# EAGLE board Primary (EAGLE 5.12), part 1 of 2
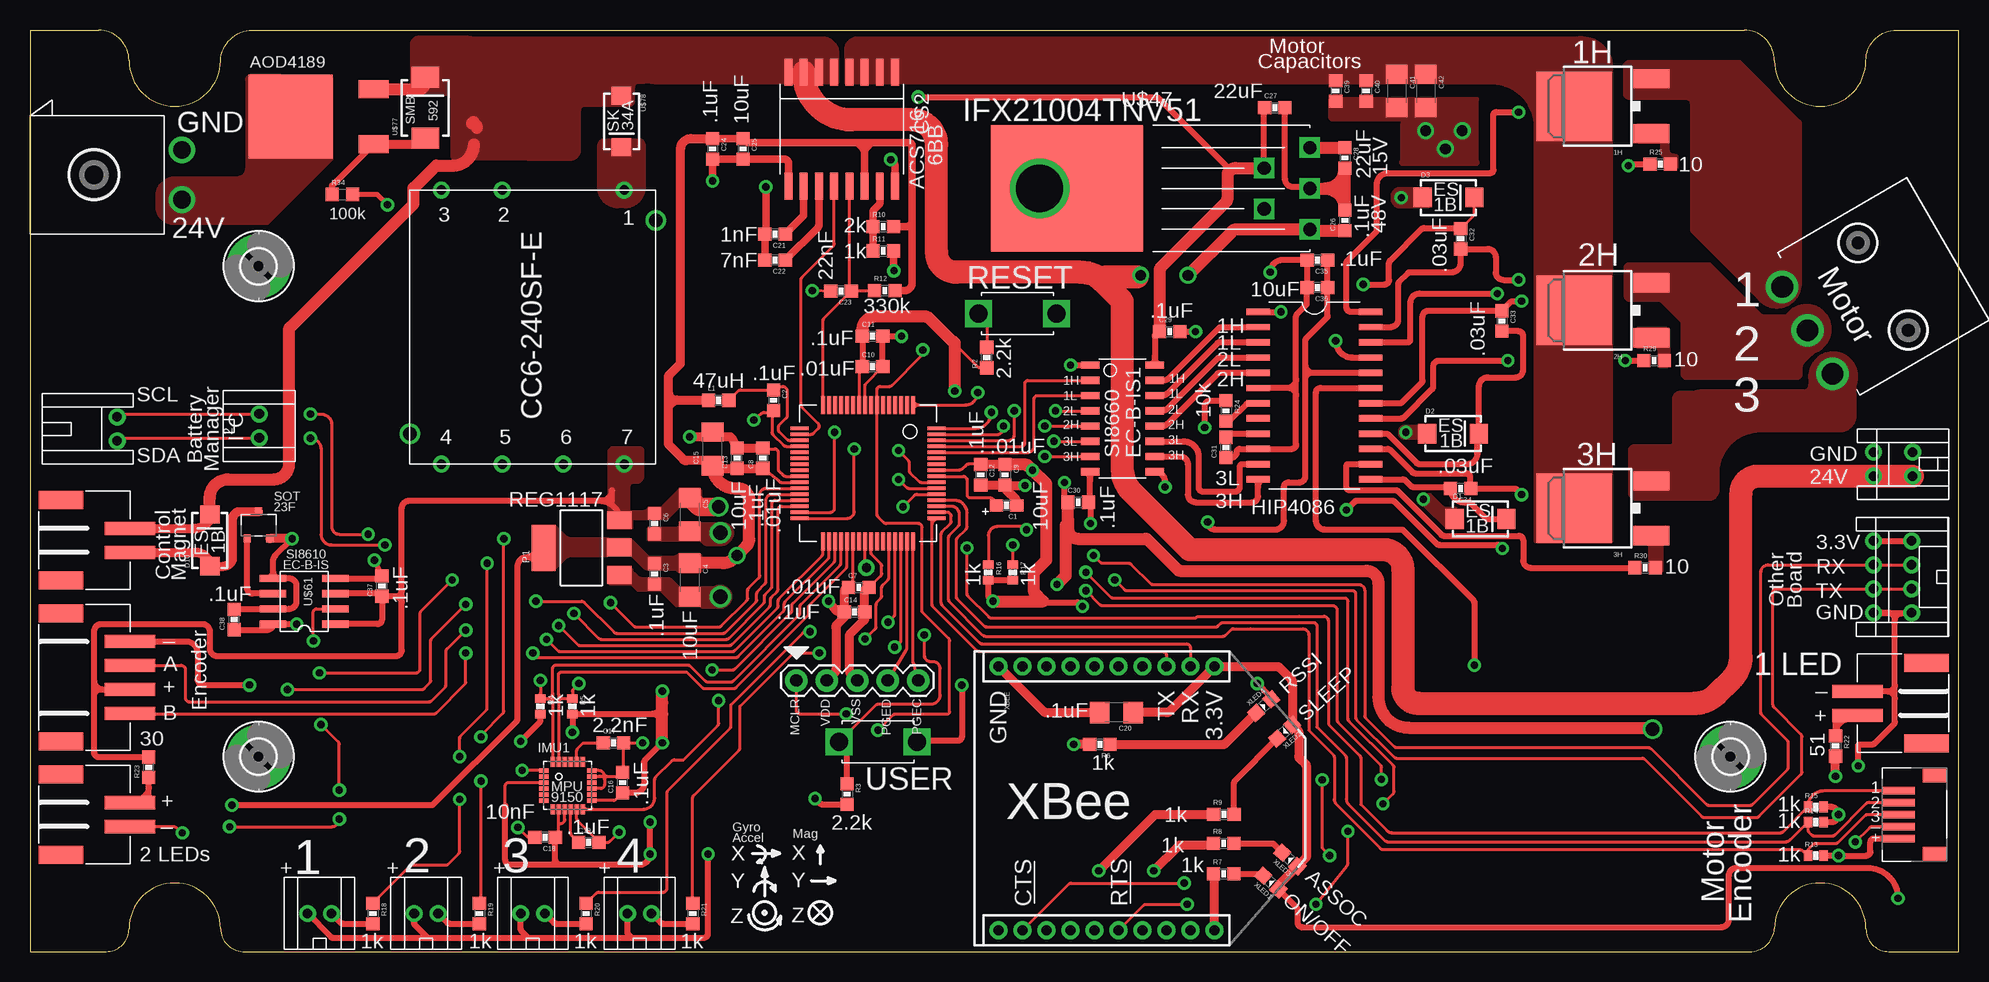
[diagram p5: board, top side]
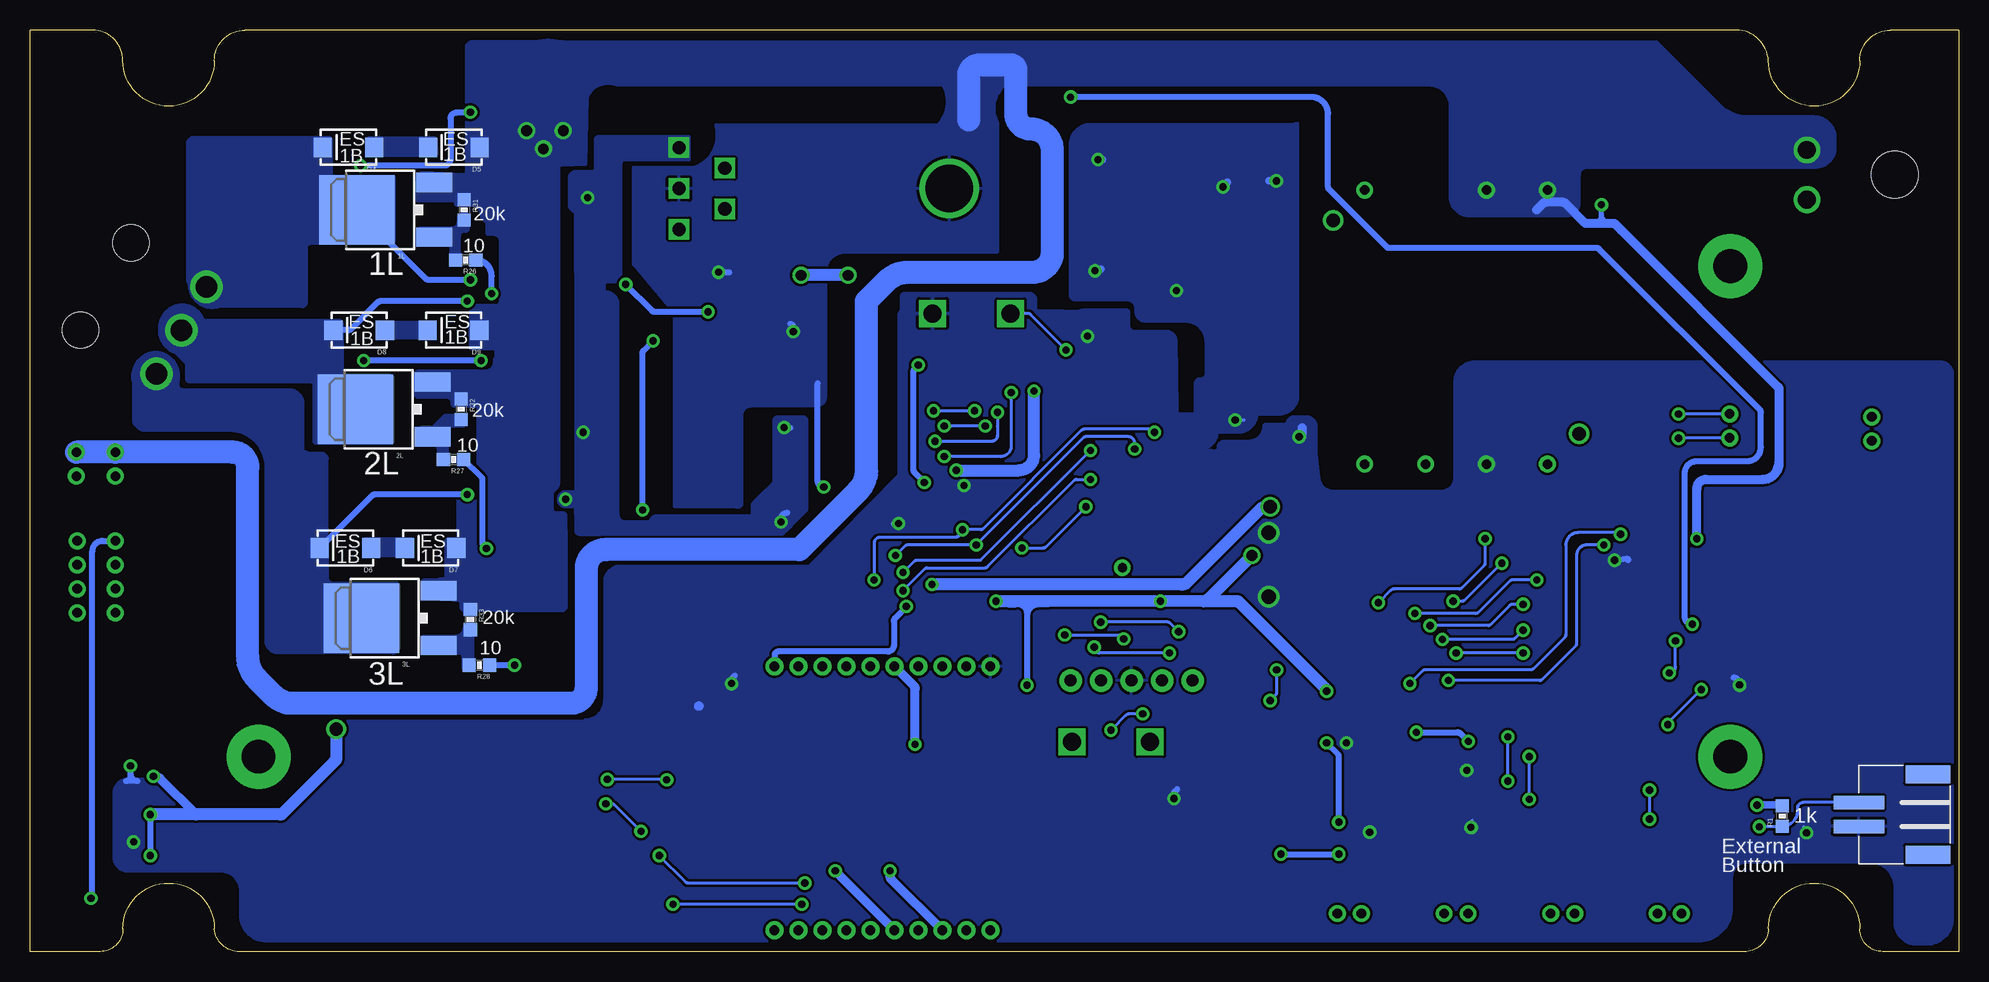
[diagram p6: board, bottom side, seen from below]

Size 160.78 x 76.85 mm. Coordinates in mm from the lower left corner, seen from the top.
Outline: 0,76.84 5.71,76.84 arc-90 8.26,74.3 arc180 15.88,74.3 arc-90 18.8,76.84 142.88,76.84 arc-90 145.41,74.3 arc180 153.03,74.3 arc-90 155.57,76.84 160.78,76.84 160.78,0.01 154.94,0.01 arc-90 153.03,1.91 arc180 145.41,1.91 arc-90 143.13,0.01 17.91,0.01 arc-90 15.88,1.91 arc180 8.26,1.91 arc-90 6.35,0.01 0,0.01 0,76.84
Copper layers (1*16): Top 0.035mm / dielectric 1.5mm / Bottom 0.035mm
Design rules "default *": minimum track width 8mil, minimum drill 20mil, track to track 8mil, track to pad 8mil, pad to pad 5mil, via to via 8mil, smd to smd 5mil, copper to edge 10mil, drill to drill 8mil, minimum pad ring 12mil, minimum via ring 10mil, stop-mask expansion 4mil, vias tented up to drill 0mil, thermal gap 10mil

## Footprints (pad centres in the part's own frame; a part is rotated, then mirrored left to right if it is on the bottom)
DPAK = smd 5.791 x 6.274: D 0,1.587 | smd 1.6 x 3: G -2.286,-4.851; S 2.286,-4.851
JST-2-PH-SMD = smd 1.1 x 4.2: 1 -1,-7.7; 2 1,-7.7 | smd 1.5 x 3.7: P$1 -3.35,-1.95; P$4 3.35,-1.95
0603-POL = smd 1.1 x 1: + 0.85,0; - -0.85,0
0603 = smd 1.1 x 1.1: 1 -0.85,0; 2 0.85,0
1206 = smd 1.6 x 1.8: 1 -1.4,0; 2 1.4,0
SOIC16-W = smd 0.65 x 2.25: 1 -4.445,-4.75; 2 -3.175,-4.75; 3 -1.905,-4.75; 4 -0.635,-4.75; 5 0.635,-4.75; 6 1.905,-4.75; 7 3.175,-4.75; 8 4.445,-4.75; 9 4.445,4.75; 10 3.175,4.75; 11 1.905,4.75; 12 0.635,4.75; 13 -0.635,4.75; 14 -1.905,4.75; 15 -3.175,4.75; 16 -4.445,4.75
SMA-DIODE = smd 1.52 x 1.63: A -2.15,0; C 2.15,0
2,8-PAD = drill 2.8 pad 5.334 round: B2,8 0,0
LGA24_4X4 = smd 0.8 x 0.35: 1 -2,1.25; 2 -2,0.75; 3 -2,0.25; 4 -2,-0.25; 5 -2,-0.75; 6 -2,-1.25; 13 2,-1.25; 14 2,-0.75; 15 2,-0.25; 16 2,0.25; 17 2,0.75; 18 2,1.25 | smd 0.35 x 0.85: 7 -1.25,-1.975; 8 -0.75,-1.975; 9 -0.25,-1.975; 10 0.25,-1.975; 11 0.75,-1.975; 12 1.25,-1.975; 19 1.25,1.975; 20 0.75,1.975; 21 0.25,1.975; 22 -0.25,1.975; 23 -0.75,1.975; 24 -1.25,1.975
JST-4-PH-SMD = smd 1.1 x 4.2: 1 -3,-7.7; 2 -1,-7.7; 3 1,-7.7; 4 3,-7.7 | smd 1.5 x 3.7: P$1 -5.35,-1.95; P$2 5.35,-1.95
JST-5-SH = smd 0.6 x 2.7: 1 2,4; 2 1,4; 3 0,4; 4 -1,4; 5 -2,4 | smd 1.2 x 2: P$6 -3.3,1; P$7 3.3,1
JST-2-PH-TH = drill 0.8 round: 1 -1,-6.35; 2 1,-6.35
1X01_TEST = drill 0.762 round: 1 0,0
JST-2-PH-V = drill 0.8 round: 1 -1,0; 2 1,0
JST-4-PH-TH = drill 0.8 round: 1 -3,-6.35; 2 -1,-6.35; 3 1,-6.35; 4 3,-6.35
JST-4-PH-V = drill 0.8 round: 1 -3,0; 2 -1,0; 3 1,0; 4 3,0
TE-MINIMATENLOK-2 = drill 1.48 round: 1 -2.07,12.67; 2 2.07,12.67 | hole 3.91: 0,5.33
MOLEX-3-MINIFITJR-RA = drill 1.803 round: 1 4.191,13.538; 2 0,13.538; 3 -4.191,13.538 | hole 3: -4.204,6.248; 4.204,6.248
SOT23F = smd 0.6 x 0.65: D 0,1.125; G -0.95,-1.125; S 0.95,-1.125
SOIC24-W = smd 0.533 x 1.981: 1 -6.985,-4.686; 2 -5.715,-4.686; 3 -4.445,-4.686; 4 -3.175,-4.686; 5 -1.905,-4.686; 6 -0.635,-4.686; 7 0.635,-4.686; 8 1.905,-4.686; 9 3.175,-4.686; 10 4.445,-4.686; 11 5.715,-4.686; 12 6.985,-4.686; 13 6.985,4.686; 14 5.715,4.686; 15 4.445,4.686; 16 3.175,4.686; 17 1.905,4.686; 18 0.635,4.686; 19 -0.635,4.686; 20 -1.905,4.686; 21 -3.175,4.686; 22 -4.445,4.686; 23 -5.715,4.686; 24 -6.985,4.686
SOT223 = smd 1.499 x 2.007: 1 -2.261,-3.15; 2 0.025,-3.15; 3 2.311,-3.15 | smd 3.81 x 2.007: 4 0,3.15
CC6-2405SF-E = drill 0.8 round: 1 -11.43,7.62; 2 -11.43,-2.54; 3 -11.43,-7.62; 4 11.43,-7.62; 5 11.43,-2.54; 6 11.43,2.54; 7 11.43,7.62 | drill 1.1 round: P$9 8.89,-10.25; P$10 -8.89,10.25
1X05-PICKIT3 = drill 1.016 pad 1.88 round: MCLR 1.27,-1.016; PGEC 11.43,-1.016; PGED 8.89,-1.016; VDD 3.81,-1.016; VSS 6.35,-1.016
0402 = smd 0.7 x 0.9: 1 -0.65,0; 2 0.65,0
TACTILE_SWITCH = drill 1.5 square: 1 -3.25,0; 2 3.25,0
TQFP64_10X10 = smd 1.5 x 0.3: 1 -5.7,3.75; 2 -5.7,3.25; 3 -5.7,2.75; 4 -5.7,2.25; 5 -5.7,1.75; 6 -5.7,1.25; 7 -5.7,0.75; 8 -5.7,0.25; 9 -5.7,-0.25; 10 -5.7,-0.75; 11 -5.7,-1.25; 12 -5.7,-1.75; 13 -5.7,-2.25; 14 -5.7,-2.75; 15 -5.7,-3.25; 16 -5.7,-3.75; 33 5.7,-3.75; 34 5.7,-3.25; 35 5.7,-2.75; 36 5.7,-2.25; 37 5.7,-1.75; 38 5.7,-1.25; 39 5.7,-0.75; 40 5.7,-0.25; 41 5.7,0.25; 42 5.7,0.75; 43 5.7,1.25; 44 5.7,1.75; 45 5.7,2.25; 46 5.7,2.75; 47 5.7,3.25; 48 5.7,3.75 | smd 0.3 x 1.5: 17 -3.75,-5.7; 18 -3.25,-5.7; 19 -2.75,-5.7; 20 -2.25,-5.7; 21 -1.75,-5.7; 22 -1.25,-5.7; 23 -0.75,-5.7; 24 -0.25,-5.7; 25 0.25,-5.7; 26 0.75,-5.7; 27 1.25,-5.7; 28 1.75,-5.7; 29 2.25,-5.7; 30 2.75,-5.7; 31 3.25,-5.7; 32 3.75,-5.7; 49 3.75,5.7; 50 3.25,5.7; 51 2.75,5.7; 52 2.25,5.7; 53 1.75,5.7; 54 1.25,5.7; 55 0.75,5.7; 56 0.25,5.7; 57 -0.25,5.7; 58 -0.75,5.7; 59 -1.25,5.7; 60 -1.75,5.7; 61 -2.25,5.7; 62 -2.75,5.7; 63 -3.25,5.7; 64 -3.75,5.7
SOIC16-N = smd 0.6 x 1.55: 1 -4.445,-2.7; 2 -3.175,-2.7; 3 -1.905,-2.7; 4 -0.635,-2.7; 5 0.635,-2.7; 6 1.905,-2.7; 7 3.175,-2.7; 8 4.445,-2.7; 9 4.445,2.7; 10 3.175,2.7; 11 1.905,2.7; 12 0.635,2.7; 13 -0.635,2.7; 14 -1.905,2.7; 15 -3.175,2.7; 16 -4.445,2.7
TO220-5 = drill 1.1 square: 1 3.81,-3.404; 2 0,-1.702; 3 3.81,0; 4 0,1.702; 5 3.81,3.404 | smd 12.7 x 10.541: PAD -16.434,0 | drill 3.937 round: PAD2 -18.72,0
SOIC8-N = smd 2.2 x 0.6: 1 -2.6,1.905; 2 -2.6,0.635; 3 -2.6,-0.635; 4 -2.6,-1.905; 5 2.6,-1.905; 6 2.6,-0.635; 7 2.6,0.635; 8 2.6,1.905
D-PAK = smd 7.01 x 7.01: D 0,0 | smd 1.499 x 2.515: G -2.286,-6.909; S 2.286,-6.909
SMB-DIODE = smd 1.75 x 2.3: A -2.54,0; C 2.54,0
XBEE-SILK = drill 0.8 pad 1.524 round: 1 -11,20; 2 -11,18; 3 -11,16; 4 -11,14; 5 -11,12; 6 -11,10; 7 -11,8; 8 -11,6; 9 -11,4; 10 -11,2; 11 11,2; 12 11,4; 13 11,6; 14 11,8; 15 11,10; 16 11,12; 17 11,14; 18 11,16; 19 11,18; 20 11,20
0603-DIODE = smd 1.1 x 1.1: AN -0.85,0; CAT 0.85,0

## Placement (x,y rotation side)
1H  IRLR024  [DPAK]  130.3,70.49 90 top
1L  IRLR024  [DPAK]  131.95,61.86 90 bottom
2H  IRLR024  [DPAK]  130.3,53.48 90 top
2L  IRLR024  [DPAK]  132.08,45.22 90 bottom
3H  IRLR024  [DPAK]  130.3,36.97 90 top
3L  IRLR024  [DPAK]  131.57,27.82 90 bottom
BUTTON  [JST-2-PH-SMD]  0.64,11.44 270 bottom
C1  10uF  [0603-POL]  81.41,37.22 180 top
C2  .1uF  [0603]  61.98,45.98 270 top
C3  .1uF  [0603]  52.07,31.5 270 top
C4  10uF  [1206]  54.99,31 270 top
C5  10uF  [1206]  54.99,36.46 270 top
C6  .1uF  [0603]  52.07,35.7 270 top
C7  .01uF  [0603]  69.09,30.36 0 top
C8  .01uF  [0603]  61.09,41.16 90 top
C9  .01uF  [0603]  81.28,39.76 270 top
C10  .01uF  [0603]  70.23,48.78 0 top
C11  .1uF  [0603]  70.23,51.32 0 top
C12  .1uF  [0603]  79.25,39.76 270 top
C13  .1uF  [0603]  58.93,41.16 90 top
C14  .1uF  [0603]  68.73,28.33 0 top
C15  10uF  [1206]  56.9,41.92 90 top
C16  .1uF  [0603]  49.4,14.11 90 top
C17  2.2nF  [0603]  48.64,17.41 0 top
C18  10nF  [0603]  42.94,9.53 180 top
C19  .1uF  [0603]  46.57,9.11 0 top
C20  .1uF  [1206]  90.56,19.95 180 top
C21  1nF  [0603]  62.1,59.83 180 top
C22  7nF  [0603]  62.1,57.67 180 top
C23  22nF  [0603]  67.6,55.09 180 top
C24  .1uF  [0603]  56.9,66.94 270 top
C25  10uF  [0603]  59.44,66.94 270 top
C26  .1uF 48V  [0603]  109.6,60.97 90 top
C27  22uF  [0603]  103.76,70.37 0 top
C28  22uF 15V  [0603]  109.6,66.18 270 top
C29  .1uF  [0603]  95,51.7 0 top
C30  .1uF  [0603]  87.38,37.47 0 top
C31  DNI  [0603]  99.69,42.05 90 top
C32  .03uF 15V  [0603]  119.25,59.44 270 top
C33  .03uF 15V  [0603]  122.68,52.59 270 top
C34  .03uF 15V  [0603]  119.25,38.62 180 top
C35  .1uF  [0603]  107.31,57.67 180 top
C36  10uF  [0603]  107.31,55.38 180 top
C37  .1uF  [0603]  29.34,30.49 90 top
C38  .1uF  [0603]  17.02,27.69 90 top
C39  .01uF  [0603]  108.84,71.76 270 top
C40  .1uF  [0603]  111.38,71.76 270 top
C41  1uF  [1206]  113.92,71.76 270 top
C42  10uF  [1206]  116.33,71.76 270 top
CS2  ACS716KLATR-6BB-T  [SOIC16-W]  67.67,68.59 180 top
D1  ES1B  [SMA-DIODE]  120.9,36.08 0 top
D2  ES1B  [SMA-DIODE]  118.62,43.19 0 top
D3  ES1B  [SMA-DIODE]  118.24,62.87 0 top
D4  ES1B  [SMA-DIODE]  134.24,67.06 180 bottom
D5  ES1B  [SMA-DIODE]  125.45,67.06 180 bottom
D6  ES1B  [SMA-DIODE]  134.49,33.66 180 bottom
D7  ES1B  [SMA-DIODE]  127.38,33.66 180 bottom
D8  ES1B  [SMA-DIODE]  133.35,51.82 180 bottom
D9  ES1B  [SMA-DIODE]  125.48,51.82 180 bottom
D10  ES1B  [SMA-DIODE]  14.99,34.3 90 top
H1  MOUNT-PAD-ROUND2.8  [2,8-PAD]  19.05,57.16 0 top
H2  MOUNT-PAD-ROUND2.8  [2,8-PAD]  19.05,16.26 0 top
H3  MOUNT-PAD-ROUND2.8  [2,8-PAD]  141.73,16.26 0 top
IMU1  MPU-9150  [LGA24_4X4]  44.83,13.85 0 top
J2  [JST-4-PH-SMD]  0.64,22.87 90 top
J5  [JST-5-SH]  159.77,11.44 90 top
J7  [JST-2-PH-TH]  160.02,40.65 270 top
JP1  M01TEST  [1X01_TEST]  69.72,32.01 0 top
JP2  [JST-2-PH-TH]  0.91,43.6 90 top
JP3  [JST-2-PH-V]  19.1,43.84 90 top
JP4  [JST-4-PH-TH]  160.02,31.25 270 top
JP5  [JST-4-PH-V]  156.84,31.25 270 top
JP6  [JST-2-PH-V]  24.13,3.18 180 top
JP7  [JST-2-PH-V]  33.02,3.18 180 top
JP8  [JST-2-PH-V]  41.91,3.18 180 top
JP9  [JST-2-PH-V]  50.8,3.18 180 top
JP10  [TE-MINIMATENLOK-2]  0,64.78 270 top
JP11  [JST-2-PH-SMD]  160.02,20.71 270 top
JP12  [JST-2-PH-V]  156.92,40.65 270 top
JP13  [JST-2-PH-SMD]  0.64,11.44 90 top
JP14  [JST-2-PH-SMD]  0.64,34.3 90 top
JP15  [MOLEX-3-MINIFITJR-RA]  159.88,58.58 120 top
L1  47uH  [0603]  57.4,45.98 0 top
M1  N-MOSSOT23F  [SOT23F]  19.05,35.57 0 top
MD1  HIP4086  [SOIC24-W]  107.06,46.36 270 top
P1  LINEAR-REG1117  [SOT223]  45.97,33.66 90 top
P2  DC-DC-CONVERTER1.2A  [CC6-2405SF-E]  41.91,52.08 270 top
PROG  [1X05-PICKIT3]  62.61,23.63 0 top
R1  1k  [0603]  14.73,11.31 90 bottom
R2  2.2k  [0603]  79.76,49.54 90 top
R3  2.2k  [0603]  68.11,13.14 270 top
R4  10k  [0402]  42.55,20.46 270 top
R5  10k  [0402]  45.21,20.46 270 top
R6  1k  [0603]  89.18,17.28 180 top
R7  1k  [0603]  99.5,6.49 0 top
R8  1k  [0603]  99.5,9.03 0 top
R9  1k  [0603]  99.52,11.45 0 top
R10  2k  [0603]  71.12,60.46 0 top
R11  1k  [0603]  71.12,58.43 0 top
R12  330k  [0603]  71.25,55.13 0 top
R13  1k  [0402]  148.84,8.01 0 top
R14  1k  [0402]  148.84,10.8 0 top
R15  1k  [0402]  148.84,12.07 0 top
R16  1k  [0402]  79.88,31.63 270 top
R17  1k  [0402]  81.92,31.63 270 top
R18  1k  [0603]  28.57,3.18 270 top
R19  1k  [0603]  37.47,3.18 270 top
R20  1k  [0603]  46.35,3.18 270 top
R21  1k  [0603]  55.24,3.18 270 top
R22  51  [0603]  150.5,17.15 270 top
R23  30  [0603]  9.91,15.38 90 top
R24  10k  [0603]  99.69,45.09 270 top
R25  10  [0603]  135.89,65.67 0 top
R26  10  [0603]  124.46,57.67 180 bottom
R27  10  [0603]  125.48,41.03 180 bottom
R28  10  [0603]  123.32,23.88 180 bottom
R29  10  [0603]  135.38,49.28 0 top
R30  10  [0603]  134.62,32.01 0 top
R31  20k  [0603]  124.59,61.86 270 bottom
R32  20k  [0603]  124.84,45.22 270 bottom
R33  20k  [0603]  124.08,27.69 270 bottom
R34  100k  [0603]  26.04,63.14 0 top
RESET1  TACTILE_SWITCH  [TACTILE_SWITCH]  82.3,53.22 0 top
U$1  DSPIC33EP512MC806  [TQFP64_10X10]  69.85,39.89 270 top
U$46  DIGITAL-ISOLATOR-6CHSI8660EC-B-IS1  [SOIC16-N]  91.06,44.46 270 top
U$47  IFX21004TNV51  [TO220-5]  102.87,63.64 0 top
U$61  DIGITAL-ISOLATOR-1CHSOIC8-N  [SOIC8-N]  22.86,29.22 180 top
U$75  AOD4189  [D-PAK]  21.73,69.62 90 top
U$77  10V  [SMB-DIODE]  32.94,70.35 90 top
U$78  SK34A  [SMA-DIODE]  49.3,69.22 270 top
USER1  TACTILE_SWITCH  [TACTILE_SWITCH]  70.68,17.48 180 top
XBEE  XBEETH  [XBEE-SILK]  78.73,12.78 270 top
XLED1  [0603-DIODE]  103.43,5.77 138 top
XLED2  [0603-DIODE]  104.58,18.35 222 top
XLED3  [0603-DIODE]  105.02,7.69 138 top
XLED4  [0603-DIODE]  102.83,20.48 42 top

## Tracks (layer width: path | path; a pad name or v marks a point on that pad's centre or on a via)
1HO
  pour Top (no thermals): 136.14,68.46 135.64,68.46 arc90 135.25,68.08
  pour Top (no thermals): 133.99,68.97 136.27,68.97 arc-90 136.53,68.72 136.53,66.94 arc90 137.03,66.43 137.16,66.43 arc-90 137.29,66.3 137.29,65.41 arc-90 137.16,65.29 136.53,65.29 arc-90 136.27,65.54 136.27,66.18 136.11,66.34 arc-45 136.02,66.56 136.02,67.45 134.24,67.45 arc-90 133.86,67.83
1HS  (via drill 0.6)
  Top 0.508: MD1.23 113.41,52.08 arc90 114.05,52.71 114.05,55.63 arc-45 114.14,55.85 114.84,56.56 arc-45 115.07,56.65 118.49,56.65 arc90 119.25,57.41 C32.2 121.5,58.59 arc-90 122.17,57.92 122.17,56.65 arc90 122.81,56.02 v124.08,56.02
  Bottom 0.508: v124.08,56.02 127.57,56.02 arc45 127.79,56.11 1L.D
  pour Bottom (no thermals): 130.68,64.65 arc90 130.56,64.52 130.56,59.19 arc90 130.68,59.06
  pour Top (no thermals): 144.27,57.18 arc-90 146.94,57.18 arc-90 146.94,54.26 arc-90 144.27,54.26 arc-90
  pour Bottom (no thermals): 144.27,57.18 arc-90 146.94,57.18 arc-90 146.94,54.26 arc-90 144.27,54.26 arc-90
  pour Bottom (no thermals): 133.22,64.52 130.56,64.52 130.56,64.02 130.56,59.06 131.32,59.06
  pour Bottom (no thermals): 130.81,64.52 arc90 130.56,64.27 130.56,59.57 arc90 130.94,59.19
  pour Bottom (no thermals): 130.94,64.52 arc90 130.56,64.14 130.56,59.57 arc90 131.06,59.06
  pour Top (no thermals): 135.23,74.19 133.25,74.19 arc90 132.88,73.82 132.88,71.57 arc90 133.29,71.17 137.96,71.17 arc-90 138.49,70.63 138.49,60.2 arc45 138.59,59.97 144.37,54.19 144.37,54.37 arc-45 144.47,54.6 147.02,57.15 147.02,56.66 arc-45 146.92,56.43 146.23,55.74 147.59,55.74 147.59,69.04 arc45 147.49,69.27 142.54,74.21
  pour Bottom (no thermals): 147.22,67.9 135.86,67.9 arc90 135.69,67.73 135.69,64.93 arc-90 135.43,64.68 130.56,64.68 arc90 130.43,64.55 130.43,59.27 arc90 130.66,59.04 137.43,59.04 arc-90 137.77,58.7 137.77,54.1 arc90 138.1,53.77 145.49,53.77 arc90 145.9,54.17 145.9,54.97 arc-90 146.67,55.75 147.47,55.75 arc90 147.62,55.9 147.62,67.27 arc90
1LO
  pour Bottom (no thermals): 124.59,61.48 124.84,61.48 arc-90 125.09,61.22 125.09,60.84 arc90 125.6,60.33 128.27,60.33 arc-90 128.4,60.21 128.4,59.06 arc-90 128.27,58.94 125.86,58.94 arc90 125.73,58.81 125.73,57.41 arc-90 125.6,57.29 125.09,57.29 arc-90 124.97,57.41 124.97,59.7 arc90 124.59,60.08 124.46,60.08 arc-90 124.21,60.33 124.21,61.35 arc-90 124.33,61.48
2HO
  pour Top (no thermals): 136.27,48.78 136.4,48.78 arc90 136.65,49.03 136.65,51.7 arc90 136.4,51.95 133.99,51.95 arc90 133.86,51.82 133.86,50.55 arc90 133.99,50.43 135.51,50.43 arc-90 135.76,50.17 135.76,48.9 arc90 135.89,48.78
2HS  (via drill 0.6)
  Top 0.508: MD1.18 114.17,45.73 arc45 114.39,45.82 115.98,47.41 arc45 116.08,47.64 116.08,52.97 arc-90 116.55,53.44 C33.1 123.39,54.14 arc-45 123.61,54.24 v124.33,54.24
  Bottom 0.508: D8.C 134.24,51.82 arc-45 134.02,51.92 131.79,54.14 arc45 131.57,54.24 v124.33,54.24
  pour Top (no thermals): 146.76,53.36 arc-90 149.43,53.36 arc-90 149.43,50.44 arc-90 146.76,50.44 arc-90
  pour Bottom (no thermals): 146.76,53.36 arc-90 149.43,53.36 arc-90 149.43,50.44 arc-90 146.76,50.44 arc-90
  pour Top (no thermals): 147.02,53.65 146.32,52.96 arc-45 146.1,52.87 142.65,52.87 138.46,57.05 arc45 138.24,57.15 135.81,57.15 133.39,57.15 arc90 133.03,56.79 133.03,54.67 arc90 133.39,54.31 135.77,54.31 arc-45 136,54.22 139.61,50.61 140.22,50 arc45 140.44,49.91 148.42,49.91 147.2,51.13 arc-45 147.1,51.36 147.1,53.56
  pour Top (no thermals): 135.69,54.31 137.34,54.31 arc-90 137.71,53.95 137.71,48.15 arc90 138.05,47.81 147.29,47.81 arc90 147.64,48.15 147.64,49.67 arc-90 147.88,49.91 147.88,52.45 arc90 147.33,52.99 144.53,52.99 arc-45 144.31,53.09 140.04,57.35 133.26,57.35 arc90 132.96,57.04 132.96,54.68 arc90 133.32,54.31
  pour Top (no thermals): 147.65,48.61 147.65,48.81 arc-45 147.74,49.03 149.21,50.5 149.21,51.38 arc45 149.12,51.6 147.22,53.5 147.22,52.67 arc-45 147.13,52.44 145.57,50.88 145.57,50.67 arc45 145.66,50.45 147.43,48.68
  pour Bottom (no thermals): 135.6,52.66 135.03,52.66 arc90 134.77,52.41 134.77,48.46 arc-90 134.4,48.09 130.78,48.09 arc90 130.54,47.85 130.54,42.54 arc90 130.72,42.36 136.94,42.36 arc90 137.1,42.52 137.1,47.2 arc-90 137.4,47.51 147.47,47.51 arc90 147.73,47.76 147.73,49.01 149.05,50.33 149.05,52.69 arc90 147.82,53.92 147.82,53.67 147.08,52.93 146.81,52.66 135.66,52.66
2LO
  pour Bottom (no thermals): 127.25,43.7 128.14,43.7 arc-90 128.52,43.32 128.52,42.55 arc-90 128.27,42.3 127.25,42.3 arc90 126.75,41.79 126.75,40.9 arc-90 126.49,40.65 126.11,40.65 arc-90 125.98,40.78 125.98,43.57 arc90 125.73,43.82 124.71,43.82 arc-90 124.46,44.08 124.46,44.59 arc-90 124.59,44.71 126.11,44.71 arc-45 126.33,44.62
3.3V  (via drill 0.6, 0.9)
  Top 0.254: U$1.10 69.1,48.36 arc-45 69.19,48.59 C10.1 | U$1.57 77.33,40.14 arc45 77.78,40.32 78.01,40.56 arc-45 78.24,40.65 79.15,40.65 arc-45 C12.1 | 67.97,30.64 arc45 68.06,30.41 C7.1 | 77.09,50.68 78.99,48.78 arc45 79.21,48.69 R2.1 | C8.1 62.42,39.23 arc45 62.64,39.14 U$1.26 | C15.1 56.9,40.94 | IMU1.13 48.62,12.6 arc45 48.84,12.69 C16.1 | 44.08,10.55 44.08,9.96 arc-45 43.99,9.73 C18.1 | 44.08,10.55 IMU1.8 | IMU1.9 44.58,11.05 arc-90 44.21,10.68 arc90 44.08,10.55 | IMU1.3 39.87,14.1 arc90 39.62,13.85 39.62,12.2 | C7.1 arc-45 68.2,30.46 | U$1.38 68.6,30.85 arc-45 68.51,30.63 C7.1
  Top 0.508: JP4.1 JP5.1 | v155.7,4.45 arc90 153.16,6.99 142.24,6.99 arc90 141.6,6.36 141.6,2.68 arc-90 140.97,2.04 106.05,2.04 arc-90 105.66,2.42 105.66,3.47 arc45 105.57,3.69 XLED1.AN | P1.4 arc90 42.8,33.64 42.8,33.03 arc-90 42.67,32.9 41.4,32.9 | C11.1 C10.1 | 41.4,32.9 arc90 42.16,33.66 42.16,32.52 arc-90 42.29,32.39 42.29,32.01 arc90 41.4,32.9 | C16.1 50.46,13.26 arc90 51.18,13.98 51.18,15.75 arc-45 51.27,15.98 v52.7,17.41 arc90 52.8,17.5 52.8,18.9 arc90 51.89,19.81 R5.2 v45.21,18.3 | 43.79,7.65 C18.1 | 44.2,7.25 arc-90 43.79,7.65 | 44.2,7.25 50.8,7.25 arc90 v51.69,8.14 v51.69,10.8 | 39.62,12.2 39.62,7.63 arc90 40.01,7.25 44.2,7.25 | 43.79,7.65 arc-90 43.38,7.25 | v40.89,17.53 42.45,19.09 arc45 42.55,19.32 R4.2 | 41.4,32.9 arc90 40.64,32.14 40.64,19.44 arc-45 40.55,19.22 33.65,12.32 arc-45 33.42,12.22 v16.83,12.22 arc45 16.89,12.2 | R17.2 R16.2 79.88,29.73 arc45 79.98,29.51 v80.26,29.22 | v56.52,8.14 56.52,1.53 arc-90 56.13,1.15 50.16,1.15 | 33.15,1.15 25.29,1.15 arc-45 25.07,1.24 JP6.2 | 33.15,1.15 41.53,1.15 | 41.53,1.15 50.16,1.15 | JP7.2 32.02,2.41 arc45 32.11,2.19 33.15,1.15 | JP8.2 40.91,1.9 arc45 41,1.68 41.53,1.15 | JP9.2 49.8,1.65 arc45 49.89,1.42 50.16,1.15 | 84.45,29.22 arc90 84.55,29.13 87.27,29.13 arc-45 87.5,29.03 v87.74,28.8 | 52.7,19.82 arc-90 52.69,19.81 | 52.7,20.77 arc-90 51.74,19.81 | v77.67,22.22 77.67,17.94 arc-90 77.32,17.59 74.03,17.59 arc90 USER1.1
  Top 0.61: C24.1 C25.1 59.69,67.54 arc45 59.91,67.45 68.96,67.45 | R12.2 72.9,55.13 arc90 73.53,55.76 73.53,60.71 | R10.2 73.02,60.46 arc45 73.47,60.65 73.53,60.71 | 68.96,67.45 69.6,67.45 | 70.1,67.45 73.28,67.45 arc-90 73.53,67.19 73.53,60.71 | 69.57,66.57 arc45 69.39,67.02 68.96,67.45 | 69.57,66.57 69.57,66.65 | 69.76,67.1 arc45 69.57,66.65 | 70.1,67.45 69.76,67.1 | 69.6,67.45 70.1,67.45 | 69.6,67.45 69.6,66.94 | 69.57,66.57 CS2.14 | 69.76,67.1 arc45 69.57,66.65
  Top 0.762: C8.1 C13.1 57.24,40.31 arc-45 57.02,40.4 C15.1 | 57.32,40.94 56.9,40.94 54.7,40.94 arc-45 54.48,41.03 53.31,42.21 arc-45 53.21,42.43 53.21,45.47 | 53.21,45.47 53.21,46.24 | 53.21,45.47 53.53,45.8 arc-45 53.98,45.98 53.85,45.98 arc-90 53.21,46.62 | 53.21,46.24 53.21,46.62 | 53.21,46.24 arc90 53.34,46.11 arc90 53.59,45.86 53.59,45.98 L1.1 | C24.1 55.08,67.79 arc90 54.23,66.94 54.23,49.16 arc-45 54.14,48.94 53.31,48.11 arc45 53.21,47.88 53.21,46.62 | C9.1 C12.1 | C14.1 67.57,28.33 arc-45 67.12,28.52 v66.56,29.23 | C14.1 67.88,30.01 arc-90 C7.1 | C20.1 94.76,19.95 arc45 94.98,20.04 XBEE.1 103.92,23.78 arc-45 104.14,23.69 105.13,22.71 arc-45 105.22,22.48 XLED2.AN arc-45 XLED2.AN 105.67,18.46 arc-45 105.77,18.24 105.77,16.32 arc45 105.86,16.1 106.31,15.65 arc-45 106.4,15.42 106.4,8.01 arc-45 106.31,7.78 XLED3.AN | PROG.VDD 67.09,23.28 arc45 67.18,23.51 67.18,27.06 arc-45 67.28,27.28 67.79,27.79 arc45 67.88,28.02 C14.1 | XLED1.AN 104.06,5.4 arc-45 104.15,5.63 XLED3.AN | 105.77,7.37 arc-45 105.67,7.15 XLED3.AN
  Top 1.016: C4.1 57.77,32.4 arc45 58.67,32.77 v58.93,33.03 59.69,33.79 arc45 59.94,34.4 59.94,37.73 arc90 59.05,38.62 58.8,38.62 arc-90 C15.1 | C11.1 69.38,51.86 arc-90 70.48,52.97 74.54,52.97 arc-45 74.99,52.78 76.9,50.87 | 77.09,50.68 76.9,50.87 | C9.1 82.97,40.61 arc-45 83.19,40.52 v83.57,40.14 84.71,39 84.71,32.65 83.69,31.63 83.69,29.98 84.45,29.22 v80.26,29.22 | v52.7,17.41 52.7,19.82 52.7,20.77 v52.7,21.72 | v77.09,46.74 77.09,50.68 | 77.09,50.68 arc90 76.9,50.87
  Bottom 0.508: JP4.1 154.73,34.25 arc-90 155.57,33.41 155.57,4.58 arc90 v155.7,4.45 | v52.7,17.41 51.78,16.48 arc45 51.69,16.26 v51.69,10.8 | v45.21,18.3 41.79,18.3 arc45 41.56,18.2 v40.89,17.53 | 79.25,29.22 79.25,28.96 | 79.25,28.96 79.88,28.96 | 79.25,28.96 78.61,28.96 | v56.52,8.14 v51.69,8.14 | 98.77,23.83 arc-90 XBEE.1 arc-90 98.72,23.79 98.72,24.71 arc90 98.4,25.03 89.28,25.03 arc-90 88.77,25.54 88.77,27.56 arc45 88.68,27.79 88.2,28.27 v87.74,28.8 | 77.74,29.22 arc90 77.67,29.16 arc90 77.66,29.14 77.66,28.23 arc-90 78.5,28.98 78.52,29.03 arc91 78.42,29.04 76.73,28.96 arc-90 77.67,27.96 v77.67,22.22
  Bottom 0.61: v16.83,12.22 14.88,12.22 arc45 R1.2
  Bottom 1.016: v83.57,40.14 78.36,40.14 arc-90 77.09,41.41 v77.09,46.74 | 63,29.22 v66.56,29.23 75.96,29.22 77.74,29.22 79.25,29.22 v80.26,29.22 | 63,29.22 arc-45 62.55,29.4 v58.93,33.03 | v52.7,21.72 arc-45 52.8,21.95 59.98,29.13 arc-45 60.2,29.22 63,29.22
  pour Top (no thermals): 48.26,34.43 49.77,34.43 arc-45 50.22,34.24 51.56,32.9 53.59,32.9 arc45 54.03,33.09 54.1,33.16 55.75,33.16 arc-90 55.88,33.03 55.88,31.76 arc-90 55.75,31.63 54.37,31.63 arc-45 53.92,31.82 53.85,31.89 51.69,31.89 51.57,31.89 arc-45 51.12,32.07 50.16,33.03 48.26,33.03 48.26,34.3
  pour Top (no thermals): 48.26,34.43 45.09,34.43 arc-45 44.65,34.61 43.81,35.44 41.91,35.44 41.91,31.89 43.69,31.89 44.65,32.84 arc-45 45.09,33.03 48.13,33.03
3HO
  pour Top (no thermals): 135.13,35.44 136.27,35.44 arc-90 136.53,35.19 136.53,34.17 arc-90 136.4,34.04 136.14,34.04 arc90 136.02,33.92 136.02,31.76 arc-90 135.89,31.63 135.13,31.63 arc-90 135,31.76 135,33.79 arc90 134.75,34.04 133.99,34.04 arc-90 133.73,34.3 133.73,35.31 arc-90 133.86,35.44
3HS  (via drill 0.6)
  Top 0.508: MD1.15 113.15,41.92 arc-45 113.38,41.83 115.22,39.98 arc45 115.45,39.89 119.76,39.89 arc-90 120.02,39.63 120.02,38.7 arc90 C34.1 123.69,38.62 arc-45 123.92,38.52 v124.33,38.11
  Bottom 0.508: D6.C 132.29,38.02 arc45 132.07,38.11 v124.33,38.11
  pour Bottom (no thermals): 148.97,49.41 arc-90 151.64,49.41 arc-90 151.64,46.49 arc-90 148.97,46.49 arc-90
  pour Top (no thermals): 148.97,49.41 arc-90 151.64,49.41 arc-90 151.64,46.49 arc-90 148.97,46.49 arc-90
  pour Bottom (no thermals): 132.21,30.62 130.18,30.23 130.18,25.41 arc90 130.43,25.15
  pour Bottom (no thermals): 130.05,25.54 arc90 130.56,25.03
  pour Bottom (no thermals): 136.78,34.43 136.4,34.43 arc90 136.02,34.04 136.02,31.25 arc-90 135.51,30.74 130.3,30.74 arc90 130.05,30.49 130.05,25.41 arc90 130.56,24.9 140.08,24.9 arc90 141.1,25.92 141.1,40.39 arc-90 144.15,43.44 151.13,43.44 arc90 152.15,44.46 152.15,48.01 arc90 151.76,48.4 148.72,48.4 arc90 148.46,48.14 148.46,47.25 arc-90 148.08,46.87 139.19,46.87 arc90 138.05,45.73 138.05,34.68 arc-90 137.67,34.3
  pour Top (no thermals): 135.13,40.65 133.99,40.65 arc90 133.35,40.01 133.35,38.24 arc90 133.86,37.73 139.95,37.73 arc90 140.72,38.49 140.72,39.89 arc-90 144.27,43.44 150.88,43.44 arc90 152.15,44.71 152.15,48.14 arc90 152.02,48.27 148.84,48.27 arc90 148.34,47.76 148.34,47.25 arc-90 147.83,46.74 139.32,46.74 arc90 137.92,45.35 137.92,41.16 arc-90 137.41,40.65
  pour Top (no thermals): 133.35,39.51 133.35,41.79 arc-90 133.73,42.17 136.78,42.17 arc90 137.03,42.43 137.03,46.11 arc-90 137.54,46.62 139.06,46.62 arc-90 139.83,45.86 139.83,38.24 arc-90 139.45,37.85 133.73,37.85 arc-90 133.35,38.24
  pour Top (no thermals): 137.03,44.71 151,45.09 arc-90 150.62,44.71 138.94,44.71 arc90 138.18,43.95
  pour Bottom (no thermals): 138.05,44.08 151.38,47.25 151.38,44.46 arc-90 151.13,44.2 151.13,44.08 150.24,44.08
  pour Bottom (no thermals): 138.05,38.38 138.05,36.41 arc-45 137.96,36.19 135.99,34.22 135.99,33.49 arc45 136.08,33.27 136.46,32.89 138.54,32.89 arc45 138.76,32.98 139.56,33.78 139.56,37.49 arc45 139.47,37.72 138.84,38.35
  pour Bottom (no thermals): 135.99,33.7 135.99,41.07 arc-90 136.47,41.55 137.63,41.58 arc-90 138.85,41.28 138.85,34.35 arc-90 138.16,33.66
3LO
  pour Bottom (no thermals): 126.62,26.3 127.89,26.3 arc-90 128.14,26.04 128.14,25.15 arc-90 127.89,24.9 124.97,24.9 arc90 124.71,24.65 124.71,23.76 arc-90 124.46,23.5 123.95,23.5 arc-90 123.83,23.63 123.83,26.42 arc90 123.7,26.55 123.7,27.19 124.46,27.19 arc-90 124.59,27.06 arc90 125.35,26.3
5V1  (via drill 0.6)
  Top 0.508: C38.1 19.79,26.84 arc90 U$61.8 v22.23,27.31 | C29.1 arc90 93.76,51.31 93.76,49.7 arc-90 93.34,48.9 U$46.16 93.47,48.9 arc90 93.76,49.19 93.76,49.63 arc90 94.23,48.9 | v74.04,71.26 93.83,71.26 arc-45 94.06,71.16 100.07,65.15 | C27.1 arc45 102.87,70.27 U$47.4
  Top 1.016: C29.1 94.15,56.68 arc-45 94.33,57.13 99.64,62.43 arc45 99.82,62.88 99.82,64.91 100.07,65.15 arc-45 100.52,65.34 U$47.4
  Bottom 0.508: v74.04,71.26 53.98,71.26 arc90 52.58,69.86 52.58,63.77 arc-45 52.48,63.54 47.72,58.78 arc-45 47.49,58.68 30.23,58.68 arc45 30.01,58.59 16.6,45.19 arc45 16.51,44.96 16.51,42.05 arc90 17.65,40.9 21.84,40.9 arc-90 22.86,39.89 22.86,27.95 arc-90 v22.23,27.31
5V2  (via drill 0.6, 1.1)
  Top 0.508: 5.33,22.61 arc90 6.08,21.87 | 5.33,22.61 5.33,26.68 arc-90 5.97,27.31 14.35,27.31 arc-90 14.99,26.68 14.99,25.28 arc90 15.62,24.65 30.48,24.65 arc90 30.99,25.15 30.99,29.09 | 30.99,29.09 30.99,29.6 | 30.99,30.11 30.99,36.97 arc-90 31.62,37.6 48.51,37.6 48.51,38.49 arc-90 47.62,37.6 47.5,37.6 arc-90 P1.3 | U$61.3 29.12,29.85 arc-90 C37.1 | U$61.1 28.96,27.31 arc90 29.34,27.69 C37.1 | 30.99,29.09 arc90 30.48,29.6 arc90 30.99,30.11 | 30.99,29.6 30.99,30.11 | 30.99,29.6 arc90 30.95,29.64 C37.1 | R15.2 150.11,12.07 arc-90 v150.75,11.44 | v150.75,11.44 arc-90 150.11,10.8 | J5.5 153.7,9.44 arc90 153.42,9.15 153.42,8.39 arc-90 153.03,8.01 v150.75,8.01 R13.2 | 150.11,10.8 R14.2 | v150.75,11.44 arc-90 150.11,10.8 | v86.74,48.9 U$46.1 | v86.23,39.12 86.23,37.9 arc45 86.33,37.67 C30.1 | R23.2 5.75,16.23 arc-90 5.33,16.65 5.33,21.34 | 5.33,21.34 5.33,22.61 | 6.08,21.87 5.86,21.87 arc90 5.33,21.34 | 6.08,21.87 J2.2
  Top 0.762: v150.5,14.61 R22.2
  Top 1.016: 86.53,36 C30.1 | 86.53,36 arc-45 86.34,35.55 86.34,31.36 v85.6,30.62 | 86.53,36 86.53,35.28 arc90 87.38,34.43 92.96,34.43 arc-45 93.18,34.33 95.67,31.85 arc45 95.89,31.76 111.38,31.76 arc-90 112.39,30.74 112.39,21.22 arc90 114.94,18.68 135.13,18.68 arc-90 v135.25,18.55 arc45 134.95,18.68
  Top 1.524: C5.1 55.66,37.19 arc45 55.89,37.09 v57.4,37.09
  Bottom 0.508: v150.75,11.44 v150.75,8.01 | v86.74,48.9 87.03,48.62 arc-45 87.12,48.39 87.12,40.14 arc-45 87.03,39.92 v86.23,39.12
  Bottom 0.762: v150.5,14.61 150.38,14.61 arc45 149.93,14.43 146.94,11.44
  Bottom 1.016: v150.75,11.44 146.94,11.44 139.96,11.44 arc-45 139.73,11.53 135.35,15.92 arc-45 135.25,16.14 v135.25,18.55 | v85.6,30.62 64.78,30.62 arc-45 64.33,30.8 58.23,36.91 arc45 57.78,37.09 v57.4,37.09
  pour Top (no thermals): 48.26,35.7 48.26,41.66 arc-90 48.64,42.05 50.8,42.05 arc-90 51.05,41.79 51.05,39.63 arc-90 50.55,39.12 50.29,39.12 arc90 49.91,38.74 49.91,36.84 arc90 50.16,36.58 50.16,35.31 48.51,35.31 arc-90 48.26,35.57
  pour Top (no thermals): 49.4,36.71 51.18,36.71 arc45 51.4,36.8 51.56,36.97 52.45,36.97 arc45 52.67,37.06 54.1,38.49 55.88,38.49 55.88,37.09 54.1,37.09 53.18,36.17 arc-45 52.95,36.08 51.69,36.08 49.4,36.08
15V  (via drill 0.6)
  Top 0.508: C35.1 C36.1 108.17,53.06 arc-45 108.07,52.84 106.39,51.16 arc45 106.3,50.93 106.3,48.9 | v98.17,35.82 arc90 98.81,35.19 103.76,35.19 arc90 104.52,35.95 104.52,38.74 arc-90 104.9,39.12 105.79,39.12 arc90 106.3,39.63 106.3,47.76 | 106.3,47.76 106.3,48.9 | 106.3,48.9 arc90 106.93,48.27 | MD1.20 106.81,48.27 arc90 106.3,47.76 | R24.1 98.39,45.94 arc90 97.92,45.47 v97.92,43.7
  Top 1.016: U$47.5 109.59,67.04 arc-90 C28.1
  Bottom 0.508: v97.92,43.7 97.41,43.7 | v98.17,35.82 98.17,36.08 arc90 97.66,36.58
  other vias: 114.3,62.87 114.68,43.32 116.14,37.73
  pour Bottom (no thermals): 105.79,67.95 112.08,67.95 arc-90 112.39,67.64 112.39,57.86 arc90 112.71,57.54 115,57.54 arc-90 115.32,57.22 115.32,35.12 arc-90 115,34.81 98.04,34.81 96.01,36.84 96.01,44.27 arc-90 96.33,44.59 98.49,44.59 arc-90 98.81,44.27 98.81,38.49 98.81,36.2 98.93,36.2 99.69,35.44 112.59,35.44 arc90 112.9,35.76 112.9,55.57 arc90 112.59,55.89 111.82,55.89 arc-90 111.51,56.21 111.51,65.73 arc90 111.19,66.05 105.79,66.05
  pour Bottom (no thermals): 112.14,64.91 arc90 113.03,64.02 115.19,64.02 arc-90 115.82,63.38 115.82,62.24 arc-90 115.32,61.73 112.65,61.73 arc90 112.14,61.22 112.14,62.87
  pour Top (no thermals): 114.3,63.64 114.17,63.64 arc90 113.54,63 113.54,62.75 arc90 114.17,62.11 116.59,62.11 116.59,63.64 115.44,63.64
  pour Top (no thermals): 114.68,42.81 114.55,42.81 arc-90 114.17,43.19 114.17,43.44 arc-90 114.55,43.82 115.82,43.82 116.84,43.82 arc-90 116.97,43.7 116.97,42.68 arc-90 116.84,42.55 115.82,42.55 arc90 115.57,42.81 114.94,42.81
  pour Bottom (no thermals): 115.32,36.46 115.32,37.98 arc90
  pour Top (no thermals): 118.62,36.58 arc-90 118.87,36.33 118.87,35.57 arc-90 118.75,35.44 118.11,35.44
  pour Bottom (no thermals): 115.32,56.65 115.32,63.38 arc90 114.94,63.76 112.27,63.76 arc90 111.89,63.38 111.89,56.65 arc90 112.01,56.52
  pour Bottom (no thermals): 111.25,67.95 113.41,67.95 arc-90 113.67,67.7 113.67,65.29 arc90 113.92,65.03 115.32,65.03 arc-90 115.82,64.52 115.82,62.49 arc-90 115.32,61.98 112.14,61.98 arc-90 111.51,62.62 111.51,66.18 arc90 111.25,66.43 111.25,67.19 arc90 111.12,67.32
  pour Bottom (no thermals): 97.16,35.82 111.12,35.82 arc90 111.76,36.46 111.76,53.98 arc-90 112.78,55 113.41,55 arc-90 113.92,54.49 113.92,35.57 arc-90 113.16,34.81 99.31,34.93 arc-90
  pour Bottom (no thermals): 98.3,39.63 100.49,37.44 arc-45 100.58,37.22 100.58,35.31 98.04,35.31 97.88,35.48 arc-45 97.79,35.7 97.79,39.76
  pour Bottom (no thermals): 100.33,36.33 108.58,36.33 arc-90 109.09,35.82 108.97,35.82 arc90 108.2,35.06 98.3,35.06 arc-90 97.79,35.57 97.79,36.08 arc-90 98.17,36.46
  pour Bottom (no thermals): 116.71,37.73 arc90 116.2,38.36 115.19,38.36 115.19,37.09 116.2,37.09 arc90 116.71,37.6
  pour Top (no thermals): 118.87,36.97 117.99,36.97 arc-45 117.76,37.06 116.71,38.11 116.08,38.11 arc90 115.7,37.73 arc90 116.2,37.22 118.11,35.31 119,35.31 119,36.58
24V  (via drill 0.9)
  Top 0.254: D10.C D10.C arc-45 15.08,36.68 15.24,36.84
  Top 0.762: JP14.2 13.7,35.3 arc90 15.24,36.84 | 92.28,56.27 arc45 v92.58,56.4
  Top 1.016: D10.C 14.99,37.85 arc-90 16.51,39.38 20.32,39.38 arc90 21.59,40.65 21.59,51.82 arc-45 21.68,52.04 31.98,62.34 31.98,63.67 31.99,63.67 33.86,65.54 35.23,65.54 arc90 37.01,67.32 | v96.52,56.4 100.17,60.05 arc-45 100.62,60.23 U$47.1 arc90 106.79,60.12 C26.1 | U$75.S 32.52,71.9 arc90 U$77.C | 36.96,69.19 36.84,69.07 arc-90 37.25,68.66
  Top 1.905: JP12.2 J7.2 144.03,39.65 arc90 142.62,38.24 142.62,24.56 arc-45 141.88,22.76 140.57,21.45 arc-45 138.78,20.71 115.7,20.71 arc-90 114.43,21.98 114.43,31.89 arc90 112.78,33.54 96.65,33.54 91.8,38.38 arc-45 91.06,40.18 91.06,54.24 89.39,55.91 | CS2.7 arc90 68.48,69.35 73.53,69.35 arc-90 75.56,67.32 75.56,58.3 arc90 77.22,56.65 87.59,56.65 arc-45 89.39,55.91 | 92.28,56.27 89.75,56.27 arc90 89.39,55.91
  Bottom 1.016: v92.58,56.4 v96.52,56.4
  pour Top (no thermals): 35.41,76.2 66.04,76.21 arc-90 67.31,74.94 67.31,72.4 52.07,72.4 arc90 43.18,66.05 35.92,66.1 arc53
  pour Top (no thermals): 41.44,66.07 45.03,66.07 arc90 45.82,66.86 45.82,70.13 arc-90 46.28,70.58 50,70.58 arc90 50.32,70.9 50.32,72.07 arc-90 50.76,72.51 51.16,72.51 arc90 51.78,73.14 51.78,73.19 arc90 51.35,73.62 43.21,73.62 arc90 41.27,71.69
  pour Top (no thermals): 36.54,76.23 32.41,76.23 arc90 31.76,75.59 31.76,71.88 arc90 32.13,71.51 34.86,71.51 arc-90 35.13,71.24 35.13,66.4 arc90 35.38,66.15 37.55,66.15 arc90 38.07,66.67 38.07,75.4 arc90 37.36,76.11
CTS  (via drill 0.6)
  Top 0.254: v112.65,14.36 112.65,15.37 arc45 112.56,15.6 109.06,19.09 arc-45 108.97,19.32 108.97,28.46 arc90 108.58,28.84 89.41,28.84 arc-45 89.19,28.93 v88.01,30.11 | U$1.54 73.26,38.64 arc-45 73.04,38.73 v72.39,39.38 | XBEE.12 86.57,5.63 arc-45 86.8,5.72 v96.2,5.72 | v108.33,8.01 107.8,8.54 arc-45 107.71,8.76 v107.71,14.33
  Bottom 0.254: v88.01,30.11 86.2,31.92 arc45 85.97,32.01 81.18,32.01 arc-45 80.95,32.11 73.77,39.29 arc45 73.55,39.38 v72.39,39.38 | v96.2,5.72 105.91,5.72 arc45 106.14,5.82 v108.33,8.01 | v112.65,14.36 107.73,14.36 arc90 v107.71,14.33
FAULT
  Top 0.254: R12.1 68.17,55.13 arc45 C23.1 | CS2.13 68.3,55.58 arc-45 68.11,55.13 C23.1 | U$1.16 66.1,52.6 arc-45 66.19,52.83 C23.1
GND1  (via drill 0.6, 0.9)
  Top 0.254: U$47.PAD2 U$47.PAD
  Top 0.406: R34.2 28.93,63.14 v29.79,62.28
  Top 0.508: 20.83,31.12 21.59,31.12 arc-90 22.23,30.49 22.23,29.22 arc-90 21.59,28.58 U$61.7 17.06,28.58 arc90 C38.2 | U$46.9 arc-90 94.61,39.16 v94.61,38.74 | C29.2 v97.16,51.7 | v21.84,34.43 20.45,33.03 arc45 20.26,32.58 20.26,31.7 | 20.26,31.7 arc-90 19.68,31.12 | 20.83,31.12 U$61.5 | 20.83,31.12 arc-90 20.26,31.69 20.26,31.7 | C27.2 104.61,64.44 arc90 105.28,63.76 106.55,63.76 arc-90 U$47.3 | v103.38,56.65 arc-90 104.39,57.67 C35.2 C36.2 arc45 106.43,55.29 106.43,54.11 arc-45 106.33,53.89 105.63,53.19 arc45 105.54,52.96 105.54,47.76 | C31.1 100.11,41.2 arc90 100.58,41.66 arc-90 100.84,41.92 MD1.10 105.16,41.92 arc90 105.54,42.3 105.54,46.36 | 105.54,46.36 105.54,47.76 | 105.54,47.76 arc-90 104.78,47 | MD1.6 104.9,47 arc-90 105.54,46.36
  Top 0.762: M1.S 21.83,34.44 arc-90 v21.84,34.43
  Top 1.016: 107.91,63.64 arc90 C28.2 | 107.91,63.64 arc-90 109.6,61.95 C26.2 109.6,65.29 | U$47.3 107.91,63.64
  Bottom 0.406: 28.14,60.16 arc90 28.5,60.51 | 30.47,60.71 arc-90 29.79,61.39 | v29.79,62.28 29.79,61.46 arc-90 29.05,60.71
  Bottom 0.508: v94.61,38.74 arc90 95.12,39.25 95.12,47.38 | v97.16,51.7 97.16,52.08 arc-90 97.41,52.33 | v103.38,56.65 102.49,56.65
  Bottom 0.762: v21.84,34.43 21.84,38.62 arc90 21.08,39.38 16.38,39.38 arc-90 14.99,40.78 14.99,46.87 arc-45 15.08,47.09 28.14,60.16 28.61,60.62 arc-45 28.83,60.71 29.05,60.71 30.47,60.71 30.98,60.71 arc45 31.21,60.81 32.8,62.4 arc-45 33.02,62.49 34.41,62.49 arc-45 34.64,62.4 35.18,61.86
  Bottom 1.905: JP12.1 J7.1 143.88,41.65 arc90 142.62,40.39 142.62,24.56 arc-45 141.88,22.76 140.46,21.34 arc-45 138.93,20.71 115.7,20.71 arc-90 114.43,21.98 114.43,31.89 arc90 112.78,33.54 96.65,33.54 91.8,38.38 arc-45 91.06,40.18 91.06,54.24 89.39,55.91 arc45 87.59,56.65 77.22,56.65 arc-90 75.56,58.3 75.56,66.81 arc-90 77.34,68.59 arc90 78.61,69.86 78.61,73.54 arc-90 78.99,73.92 81.66,73.92 arc-90 82.55,73.03 82.55,69.35
  other vias: 116.33,68.46 117.98,66.94 119.38,68.46
  pour Bottom (no thermals): 30.99,65.41 11.94,65.41 arc-90 10.29,67.06 10.29,67.83 arc-90 12.06,69.6 17.61,69.6 arc45 19.85,70.53 25.15,75.83 116.59,75.83 arc-90 120.65,73.8 120.65,65.41 114.43,65.67 114.3,71.26 arc90 111.89,72.27 44.2,72.27 arc90 42.42,70.49 42.42,63 arc-90 40.77,61.35 32.77,61.35 arc-90 31.62,62.49 31.62,64.78 arc90
  pour Top (no thermals): 108.33,71 108.33,69.6 arc90 108.58,69.35 114.3,69.35 arc-90 114.3,68.97 114.3,65.92 arc90 114.3,65.67 120.65,65.67 arc90 120.65,65.92 120.65,71 arc90 120.65,71.13 108.46,71.13 arc90
  pour Bottom: 79.12,72.53 arc-90 80.14,69.1 80.14,58.3 92.84,58.3 arc-90 94.49,56.65 94.49,46.24 arc90 95.25,45.47 100.71,45.47 arc-90 101.47,44.71 101.47,37.22 arc90 101.98,37.09 107.06,37.09 107.06,53.22 110.49,57.29 110.49,65.41 105.41,65.41 arc-90 103.63,68.97 85.09,68.97 arc-90 85.09,72.78 79.25,72.78 arc90
  pour Bottom (no thermals): 117.6,68.33 arc90 117.98,67.95 118.24,65.67 arc-90 117.73,66.18
  pour Bottom (no thermals): 127.13,64.91 128.14,64.91 arc-90 128.4,64.65 128.4,63.64 arc-90 128.27,63.51 125.35,63.51 arc90 125.09,63.25 125.09,62.49 arc-90 124.97,62.37 124.33,62.37 arc-90 124.21,62.49 124.21,64.4 arc-90 124.59,64.78
  pour Bottom (no thermals): 127.13,48.27 128.14,48.27 arc-45 128.36,48.18 128.52,48.01 128.52,47.13 arc-45 128.43,46.91 128.4,46.87 125.73,46.87 arc90 125.35,46.49 125.35,45.98 arc-90 125.09,45.73 124.71,45.73 arc-90 124.46,45.98 124.46,46.61 arc-45 124.55,46.84 125.86,48.14
  pour Bottom (no thermals): 126.11,30.87 127.89,30.87 arc-90 128.14,30.62 128.14,29.73 arc-90 127.89,29.47 125.09,29.47 arc90 124.59,28.96 124.59,28.33 arc-90 124.46,28.2 123.83,28.2 arc-90 123.7,28.33 123.7,30.36 arc-90 124.21,30.87
  pour Bottom (no thermals): 123.83,67.83 117.98,67.83 arc90 117.6,67.45 117.6,66.05 arc90 117.86,65.79 118.87,65.79 arc90 119.25,66.18 119.25,66.3 arc-90 119.51,66.3 123.95,66.43 123.95,67.57 arc-90 124.08,67.7
  pour Bottom (no thermals): 124.71,64.78 124.59,64.78 arc90 124.21,64.4 124.21,63.76 arc-90 123.83,63.38 122.3,63.38 arc-90 121.92,63.76 121.79,67.7 118.49,67.7 arc90 118.36,67.57 118.36,62.11 arc90 118.87,61.6 122.43,61.6 arc90 122.94,62.11 arc-90 123.19,62.37 124.71,62.37 arc90 124.97,62.62 124.97,64.4 arc90 124.71,64.65
  pour Bottom (no thermals): 118.36,62.75 118.36,51.57 arc90 118.87,51.06 123.83,51.06 arc90 124.08,51.32 124.08,52.33 arc90 123.83,52.59 121.28,52.59 arc-90 121.03,52.84 121.03,59.44 arc-90 122.3,60.71 arc90 123.19,61.6 123.19,62.75 122.56,62.75
  pour Bottom (no thermals): 127.51,48.27 125.99,48.27 arc45 125.76,48.18 124.33,46.74 122.56,46.74 arc-90 121.92,47.38 121.92,51.7 arc90 121.54,52.08 118.75,52.08 arc90 118.36,51.7 118.36,46.11 arc90 119,45.47 123.83,45.47 arc90 123.95,45.6 124.84,45.6 arc90 125.35,46.11 125.35,46.36 arc-90 125.73,46.74 126.62,46.74 arc90 127.38,47.51
  pour Bottom (no thermals): 125.09,34.43 125.73,34.43 arc-90 125.98,34.17 125.98,31.25 arc90 126.24,31 127.89,31 arc-90 128.14,30.74 128.14,29.6 arc-90 128.02,29.47 124.59,29.47 arc-90 124.33,29.73 124.33,34.17 arc-90 124.59,34.43
  pour Bottom (no thermals): 118.24,47.25 118.24,38.62 arc90 118.75,38.11 119,38.11 arc-90 119.38,37.73 119.38,29.22 arc90 120.14,28.46 124.59,28.46 arc90 124.84,28.71 124.84,28.96 arc-90 125.22,29.35 126.49,29.35 arc90 126.62,29.47 126.62,31.12 122.3,31.12 arc-90 121.67,31.76 121.67,40.01 arc-45 121.76,40.23 123.44,41.92 123.44,45.6 arc45 123.35,45.82 122.81,46.36 121.54,46.36 arc-45 121.32,46.46 120.27,47.51
  pour Bottom (no thermals): 122.17,64.65 arc90 122.94,63.89 123.06,63.89 arc90 123.95,64.78 126.49,64.78 arc-90 126.87,64.4 128.14,64.4 arc-90 128.52,64.02 128.52,62.75 arc-90 128.4,62.62 122.17,62.62 arc-90 121.16,63.64 121.16,66.05 arc-90 121.79,66.68 122.56,66.68 arc-90 122.94,66.3 arc90 122.05,65.41 122.05,65.29
  pour Bottom (no thermals): 124.46,34.43 124.21,34.43 arc90 123.83,34.04 123.83,33.03 arc-90 122.68,31.89 122.56,31.89 arc-90 121.54,32.9 120.65,32.9 arc90 120.27,32.52 120.27,30.36 arc90 121.03,29.6 125.86,29.6 arc90 126.11,29.85 126.11,34.17 arc90 125.86,34.43
  pour Bottom (no thermals): 118.75,67.95 116.97,67.95 arc90 116.71,67.7 116.71,39.25 arc90 117.73,38.24 117.86,38.24 arc-90 118.24,37.85 118.24,36.33 arc-90 117.47,35.57 116.71,35.57 arc90 116.08,34.93 116.08,28.84 arc90 116.46,28.46 121.92,28.46 arc90 122.3,28.84 122.3,31.25 arc90 121.54,32.01 121.54,52.21 arc90 120.9,52.84 120.9,55.13 arc-90 121.54,55.76 121.54,59.19 arc-90 122.17,59.83 122.56,59.83 arc90 122.68,59.95 122.68,63.51 arc90 122.17,64.02 122.05,64.02 arc-90 121.16,64.91 121.16,67.7 arc90 120.9,67.95
  pour Bottom (no thermals): 122.05,49.41 122.05,49.16 arc90 122.81,48.4 128.4,48.4 arc-90 128.65,48.14 128.65,46.49 arc-90 128.4,46.24 125.98,46.24 arc90 125.6,45.86 125.6,45.73 arc-90 125.35,45.47 121.67,45.47 arc-90 121.28,45.86 121.28,49.28 arc-90 121.41,49.41
  pour Bottom (no thermals): 123.19,67.7 123.19,69.6 arc45 123.1,69.82 120.4,72.53 120.4,71.13 arc-45 120.3,70.91 118.75,69.35 118.75,66.82 arc45 118.84,66.59 119.13,66.3 121.66,66.3 arc45 121.89,66.4 122.81,67.32
  pour Bottom (no thermals): 122.68,70.37 124.11,68.94 arc-45 124.21,68.71 124.21,64.78 125.22,64.78 arc-90 125.35,64.65 125.35,62.37 arc-90 125.22,62.24 123.7,62.24 arc90 123.32,61.86 120.52,61.86 arc-90 119.76,62.62 119.76,70.11 arc-90 120.27,70.62 122.3,70.62 arc-90 122.43,70.49
  pour Bottom (no thermals): 116.08,34.55 116.08,36.33 arc-90 116.33,36.58 116.97,36.58 arc90 117.22,36.84 117.22,39 arc-90 117.47,39.25 121.41,39.25 arc-90 121.67,39 121.67,32.39 arc90 122.05,32.01 124.84,32.01 arc-90 125.98,30.87 125.98,29.85 arc-90 125.48,29.35 117.98,29.35 arc-90 116.08,31.25
  pour Bottom (no thermals): 122.3,41.16 122.3,34.3 arc-45 122.21,34.08 121.28,33.16 118.5,33.16 arc-45 118.27,33.25 117.98,33.54 117.98,47.63 arc-90 118.62,48.27 125.48,48.27 arc-90 126.11,47.63 126.11,47 arc-90 125.73,46.62 123.32,46.62 arc90 122.43,45.73
  pour Bottom (no thermals): 123.46,43.2 123.46,40.42 arc45 123.55,40.2 125.12,38.63 125.12,32.76 arc-45 125.09,32.7 124.53,32.7 arc45 124.3,32.61 123.61,31.91 121.57,31.91 arc-45 121.34,32 120.42,32.93 120.42,36 arc-45 120.51,36.22 122.06,37.77 122.06,42.43 arc-45 122.15,42.66 122.62,43.13
  pour Bottom (no thermals): 116.33,75.87 123.93,75.87 arc-90 124.42,75.37 124.42,65.11 arc-90 124.14,64.83 117.49,64.83 arc-90 117.03,65.29 117.03,74.09 arc90 116.55,74.57 arc90 116.2,74.91 116.2,75.61 arc-90 116.27,75.68
  pour Bottom (no thermals): 121.6,55.71 121.6,54.14 arc90 121.86,53.88 123.84,53.88 arc-90 124.1,53.62 124.1,50.43 arc-90 123.95,50.28 121.08,50.28 arc-90 120.71,50.64 120.71,55.48 arc-90 120.98,55.75
GND2  (via drill 0.6, 1.2)
  Top 0.254: BUTTON.2 11.95,10.44 arc-40 12.15,10.37 v12.7,9.91 | 63.5,39.64 U$1.25 62.99,39.64 arc-45 62.77,39.73 62.45,40.05 arc-45 62.36,40.27 62.36,41.66 arc90 62.1,41.92 61.43,41.92 arc-90 C8.2 | C23.2 65.31,55.15 arc45 v65.22,55.11 | U$1.9 69.6,47.16 arc-45 69.69,47.39 C10.2 | 69.94,30.7 C7.2 70.9,31.32 arc45 70.99,31.55 70.99,32.14 arc45 70.9,32.36 70.19,33.07 arc-45 70.1,33.29 U$1.41 arc-45 70.1,34.18 70.1,33.79 | IMU1.1 arc90 42.81,15.12 v41.02,15.12 | v51.05,17.41 C17.2 49.49,15.17 arc-45 C16.2 arc-90 49.05,14.6 47.9,14.6 | IMU1.18 47.4,15.1 arc-90 47.9,14.6 | 47.88,14.36 47.88,14.58 arc-90 47.9,14.6 | 47.88,14.36 47.88,13.92 arc-90 47.56,13.6 IMU1.15 | 47.9,14.6 47.44,14.63 arc90 47.43,14.63 | 47.65,14.63 arc90 47.85,14.82 47.85,14.78 | 47.85,14.78 47.85,14.65 arc90 47.94,14.56 47.94,14.58 arc90 47.89,14.63 47.65,14.63 | 47.52,14.63 47.65,14.63 | 47.52,14.63 47.62,14.61 arc-90 47.88,14.36 | 47.43,14.63 47.48,14.63 47.5,14.63 47.52,14.63 | 47.88,14.36 arc-90 48.12,14.6 | 48.06,14.6 48.03,14.6 | 47.85,14.78 arc90 48.03,14.6 | 47.85,14.78 arc90 48.03,14.6 | 48.12,14.6 48.42,14.6 | 48.12,14.6 48.06,14.6 | 48.06,14.6 arc-90 47.87,14.79 47.87,14.63 arc-90 47.84,14.6 47.52,14.63 | 47.43,14.63 46.86,14.63 arc90 IMU1.17 | C18.2 41.62,9.53 arc-45 41.4,9.63 v40.66,10.36 | v49.11,9.97 48.35,9.21 arc-45 48.13,9.11 C19.2 45.67,10.86 arc-45 45.58,11.09 IMU1.11 | 153.56,10.44 J5.4 | 153.34,10.35 arc-45 153.56,10.44 | 153.34,10.35 arc-45 153.56,10.44 | v152.15,9.15 153.34,10.35 | C2.2 arc90 61.85,45.01 61.85,44.97 | 61.85,43.32 arc45 61.94,43.1 | 61.94,43.1 62.81,42.23 arc45 63.03,42.14 U$1.20
  Top 0.254: 61.85,43.32 arc45 61.94,43.1 | 61.85,44.97 61.85,43.32 | 61.85,44.97 61.22,44.97 arc45 60.99,44.87 v60.33,44.33
  Top 0.508: JP5.4 JP4.4 154.89,28.25 arc-90 155.45,27.69 arc-90 155.96,28.2 155.7,28.2 arc90 155.45,27.95 155.45,22.23 | 155.45,21.09 155.45,22.23 | 155.45,21.09 155.45,19.19 arc-45 155.35,18.97 153.76,17.37 arc-45 153.54,17.28 152.4,17.28 v152.4,15.5 | 155.45,21.09 arc90 154.83,21.71 | 154.83,21.71 154.92,21.71 arc90 155.45,22.23 | 154.83,21.71 JP11.1 | 8.26,25.87 J2.4 13,25.87 arc-90 13.97,24.9 13.97,22.74 arc90 14.48,22.23 v18.29,22.23 | v28.7,32.65 C37.2 arc-90 29.12,31.12 U$61.4 | C10.2 C11.2 v72.64,51.32 | v88.39,35.7 88.39,37.47 88.36,37.47 | C30.2 88.36,37.47 | 88.36,39.28 arc90 87.88,40.01 U$46.8 | 88.36,37.47 88.36,39.28 | 88.77,40.01 arc90 88.36,39.47 88.36,39.28 | R3.2 66.03,12.29 arc-45 65.81,12.38 v65.43,12.76 | XLED4.CAT 103.46,21.06 arc45 103.37,21.29 v102.3,22.36
  Top 0.61: v56.9,64.27 C24.2 C25.2 62.83,66.09 arc-90 63.25,65.67 63.25,63.86 arc-90 CS2.9 | R11.2 71.97,57 arc45 v72.01,56.78 | CS2.16 72.11,65.43 arc45 71.92,65.88 v71.75,66.05 | v61.34,63.76 61.34,60.04 arc-45 C21.2 C22.2
  Top 0.762: 56.51,42.93 arc90 C15.2 | C9.2 arc45 81.37,38.87 v82.93,38.87 | C12.2 C9.2 | 58.25,42.93 arc-45 58.47,42.84 | 58.47,42.84 C13.2 C8.2 | 58.25,42.93 arc-45 58.47,42.84 | 56.51,42.93 58.25,42.93 | C1.- arc-45 82.17,37.43 82.17,37.73 81.37,38.52 arc-45 81.28,38.75 C9.2 | v54.99,42.93 56.51,42.93 | C7.2 arc90 69.58,30.01 C14.2 69.58,27.83 arc-45 69.49,27.6 68.33,26.44 68.33,23.38 arc45 68.42,23.16 PROG.VSS | C20.2 84.7,19.95 arc-45 84.47,20.04 XBEE.10
  Bottom 0.254: v12.7,9.91 12.95,10.42 12.95,10.17 | v65.22,55.11 64.76,55.16 | v41.02,15.12 40.77,15.12 | v51.05,17.41 51.05,17.53 arc-45 51.15,17.75 51.18,17.79 | v40.66,10.36 40.66,10.74 arc45 40.58,10.96 | v49.11,9.97 arc45 49.15,9.98 49.48,10.31 | v152.15,9.15 152.15,8.77 | 60.58,43.95 60.55,43.98 | v60.33,44.33 60.45,44.46 | v60.33,44.33 60.45,44.21 | v60.33,44.33 59.56,44.33
  Bottom 0.508: v72.64,51.32 72.9,51.32 | v88.39,35.7 88.77,35.7 | v28.7,32.65 27.69,32.77 arc90 27.56,32.65 | v18.29,22.23 18.29,22.36 arc-90 18.8,22.87 | 152.4,14.82 v152.4,15.5 | 152.4,14.82 arc-90 151.82,14.23 152.78,14.23 arc-90 152.4,14.61 152.4,14.82 | v65.43,12.76 65.43,13.14 arc45 65.34,13.36 65.15,13.55 | v102.3,22.36 102.3,22.61 arc45 102.21,22.83 102.04,23
  Bottom 0.61: v56.9,64.27 57.53,64.27 | v72.01,56.78 71.5,56.9 | v71.75,66.05 71.37,66.05 | v61.34,63.76 60.96,64.14
  Bottom 0.762: v54.99,42.93 arc-90 54.74,43.19 54.74,43.7 | v82.93,38.87 82.97,38.9 | 104.99,20.48 arc-45 105.09,20.46 104.99,20.48
  other vias: 57.53,29.6 57.53,34.93
  pour Bottom: 143.13,21.09 148.97,21.09 arc-90 149.73,20.33 149.73,15.76 arc90 151.13,14.36 152.65,14.36 arc-90 153.8,13.22 153.8,7.88 arc-90 152.65,6.74 144.91,6.74 arc90 143.26,5.09 143.26,3.06 arc-90 141.1,0.9 21.72,0.9 arc-90 18.92,3.69 18.92,6.23 arc90 17.65,7.5 7.49,7.5 arc90 5.33,5.34 5.33,2.42 arc-90 3.56,0.64 2.67,0.64 arc-90 0.51,2.8 0.51,48.14 arc-90 1.52,49.16 40.39,49.16 arc-90 42.04,47.51 42.04,39.51 arc90 43.18,38.36 52.07,38.36 arc90 53.34,39.63 53.59,41.92 arc-90 54.74,43.32 62.87,41.41 arc90 63.75,39.89 arc90 69.34,53.35 87.76,53.6 arc-90 88.39,52.97 88.39,31.89 arc90 89.92,30.36 107.44,30.36 arc-90 109.6,28.2 109.6,20.96 arc90 111.38,19.19 141.22,19.19 arc90
  pour Bottom (no thermals): 39.37,41.66 40.13,41.66 arc-90 40.26,41.54 40.26,39.76 arc-90 40.13,39.63 38.48,39.63 arc-90 38.35,39.76 38.35,41.54 arc-90 38.48,41.66
  pour Top (no thermals): 57.4,30.49 57.53,30.49 arc-90 58.42,29.6 arc-90 57.53,28.71 56.14,28.71 arc-45 55.91,28.8 55.88,28.84 54.23,28.84 53.98,28.84 arc-45 53.76,28.93 52.58,30.11 51.56,30.11 50.8,30.11 arc-45 50.58,30.2 50.16,30.62 48.51,30.62 arc-90 48.26,30.87 48.26,31.89 arc-90 48.39,32.01 49.91,32.01 arc-90 50.16,31.76 arc90 50.42,31.5 50.71,31.22 arc45 50.93,31.12 51.44,31.12 52.45,31.12 53.08,31.12 arc-45 53.53,30.94 54.1,30.36 56.97,30.36 arc45 57.28,30.49
  pour Top (no thermals): 51.56,35.31 53.85,35.31 arc90 54.23,35.7 57.78,35.7 arc-90 58.55,34.93 arc-90 57.53,33.92 56.52,33.92 arc-45 56.08,34.1 55.88,34.3 51.56,34.3
  pour Bottom: 87.63,36.33 89.03,36.33 arc-90 89.53,35.82 89.53,35.31 arc-90 89.03,34.81 87.63,34.81 87.63,35.57
  pour Bottom: 88.27,40.9 88.27,40.02 arc45 88.36,39.79 95.89,32.14 111.51,32.14 arc-90 112.9,30.87 112.9,20.96 arc90 114.55,19.31 114.55,18.8 arc-90 114.3,18.55 103.95,18.55 arc-90 101.66,20.84 101.66,24.65 arc90 97.79,27.82 83.19,27.82 arc-90 81.79,29.22 81.79,40.39 arc-90 82.17,40.78
  pour Bottom: 55.5,68.97 72.39,68.97 arc-90 74.04,67.32 74.04,54.75 arc-90 73.66,54.36 69.34,54.36 arc90 68.58,53.6 68.58,53.35 arc-90 67.82,52.59 64.52,52.59 arc90 62.74,50.81 62.74,48.14 arc90 63.12,47.76 63.25,47.76 arc-90 63.63,47.38 63.63,43.44 arc90 64.14,42.93 65.28,42.93 65.28,41.92 63.25,41.92 arc-90 61.85,43.32 60.07,43.32 arc-90 58.55,44.84 56.64,44.84 arc-90 55.12,46.36 55.12,69.1
  pour Bottom: 53.59,40.01 53.59,43.82 arc-90 54.36,44.59 55.37,44.59 arc-90 56.01,43.95 57.78,43.95 arc-90 57.91,43.82 arc90 59.18,42.55 61.21,42.55 arc-90 61.72,42.05 61.72,41.92 arc90 62.36,41.79 64.52,41.92 arc90 65.15,42.3 65.28,50.94 arc-90 66.04,51.7 68.71,51.7 arc90 69.22,52.21 69.22,53.35 arc-90 69.34,53.48 73.03,53.48 arc-90 73.66,52.84 73.66,39.51 arc-90 73.15,39 54.61,39 arc-90
  pour Bottom: 76.96,52.33 76.96,54.36 arc-90 77.47,54.87 87.88,54.87 arc-90 88.14,54.62 88.14,51.32 arc-90 87.76,50.94 77.47,50.94 arc-90 76.96,51.44
  pour Bottom: 59.82,44.84 67.06,44.84 arc-90 67.56,44.33 67.56,42.43 arc-90 66.93,41.79 63.5,41.79 arc-90 61.85,43.44 60.45,43.44 arc-90 59.82,44.08
HALL1  (via drill 0.6)
  Top 0.254: J5.1 149.56,13.44 arc90 R15.1 | R15.1 148,12.27 | v78.11,33.66 78.11,29.86 arc45 78.2,29.63 79.92,27.91 arc45 80.14,27.82 97.11,27.82 arc45 97.19,27.86 arc-45 97.41,27.95 105.79,27.95 arc-90 105.8,27.96 107.82,27.96 arc-90 108.23,27.55 108.23,18.96 110.84,16.35 arc-45 110.93,16.12 110.93,12.27 113.1,10.1 arc45 113.55,9.91 145.9,9.91 arc45 146.13,10.01 R15.1 | U$1.53 73.95,38.14 arc45 73.72,38.04 v72.77,37.09
  Bottom 0.254: v78.11,33.66 76.33,33.66 arc-45 76.11,33.76 v72.77,37.09
HALL2
  Top 0.254: J5.2 155.75,12.45 153.29,12.45 arc45 153.07,12.36 150.46,9.75 arc-45 150.24,9.66 148.72,9.66 arc-45 148.5,9.75 148.29,9.96 arc-45 148.19,10.19 R14.1 146.73,9.34 arc-45 146.28,9.15 113.29,9.15 arc-45 112.84,9.34 109.91,12.27 arc-45 109.73,12.72 109.73,16.13 arc45 109.64,16.36 107.26,18.73 107.26,27.17 arc90 107,27.44 104.14,27.44 103.63,27.44 99.44,27.44 arc45 99.22,27.35 99.03,27.15 arc-45 98.8,27.06 79.76,27.06 arc-45 79.54,27.15 77.31,29.38 arc-45 77.22,29.6 77.22,34.29 arc-45 77.31,34.52 78.01,35.22 arc45 78.11,35.45 78.11,36.58 arc90 77.05,37.64 U$1.52
HALL3